# Altium schematic sheet PSU_LM20125_ADJ.SchDoc: Power Supply MAX1831 (1V2)
size A4; Organization: Altium Limited.; Address1: Level 3, 12a Rodborough Rd; Address2: Frenchs Forest 2086; Address3: NSW; Address4: AUSTRALIA; SheetNumber: 1; SheetTotal: 100; PageSetup: Record=PageOptions|CenterHorizontal=True|CenterVertical=True|PrintScale=0.97|XCorrection=1.00|YCorrection=1.00|PrintKind=1|BorderSize=5000000|LeftOffset=0|BottomOffset=0|Orientation=2|PaperLength=1000|PaperWidth=1000|Scale=100|PaperSource=7|PrintQuality=-4|MediaType=1|DitherType=10|PaperKind=A4 (210 x 297 mm)|PrintScaleMode=1
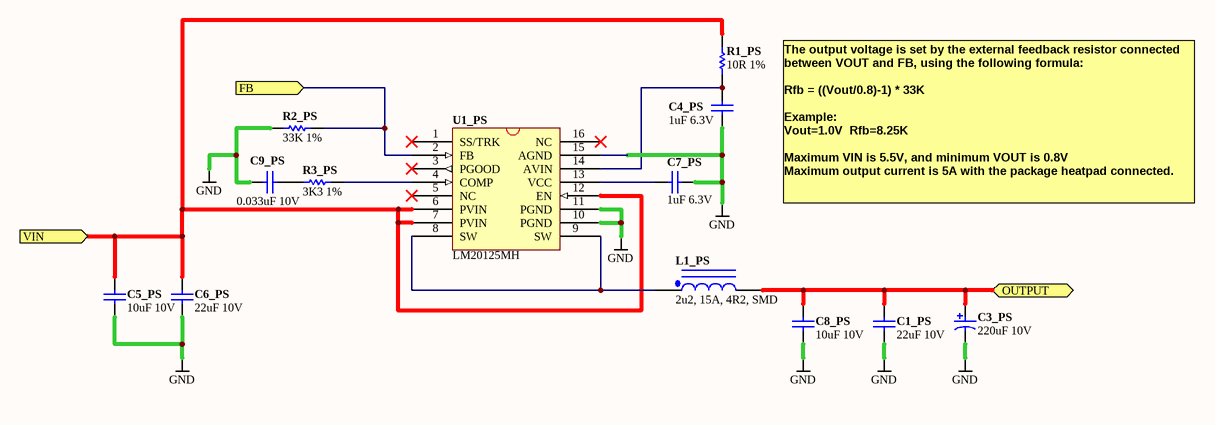
[diagram p0: PSU_LM20125_ADJ.SchDoc]

## Parts
C1_PS  22uF 10V  [CAPC3225-STAR]
C3_PS  220uF 10V  [CAPC7343-STAR]
C4_PS  1uF 6.3V  [CAPC1005-STAR]
C5_PS  10uF 10V  [CAPC2012-STAR]
C6_PS  22uF 10V  [CAPC3225-STAR]
C7_PS  1uF 6.3V  [CAPC1005-STAR]
C8_PS  10uF 10V  [CAPC2012-STAR]
C9_PS  0.033uF 10V  [CAPC1005-STAR]
L1_PS  2u2, 15A, 4R2, SMD  [IND-EPCOS-SMD-B82559]
R1_PS  10R 1%  [RESC1005-STAR]
R2_PS  33K 1%  [RESC1005-STAR]
R3_PS  3K3 1%  [RESC1005-STAR]
U1_PS  LM20125MH  [TSOP65P638-16]

## Ports
FB (in), OUTPUT (bidir), VIN (in)

## Nets
GND: C1_PS.2 C3_PS.2 C4_PS.2 C5_PS.2 C6_PS.2 C7_PS.2 C8_PS.2 C9_PS.1 R2_PS.1 U1_PS.10(PGND) U1_PS.11(PGND) U1_PS.15(AGND)
FB: R2_PS.2 U1_PS.2(FB) ; port FB
OUTPUT: C1_PS.1 C3_PS.1 C8_PS.1 L1_PS.2 ; port OUTPUT
VIN: C5_PS.1 C6_PS.1 R1_PS.1 U1_PS.6(PVIN) U1_PS.7(PVIN) U1_PS.12(EN) ; port VIN
NetC4_PS_1: C4_PS.1 R1_PS.2 U1_PS.14(AVIN)
NetC7_PS_1: C7_PS.1 U1_PS.13(VCC)
NetC9_PS_2: C9_PS.2 R3_PS.1
NetL1_PS_1: L1_PS.1 U1_PS.8(SW) U1_PS.9(SW)
NetR3_PS_2: R3_PS.2 U1_PS.4(COMP)

Not connected (* = marked no-connect by the designer): U1_PS 1(SS/TRK)* 3(PGOOD)* 5(NC)* 16(NC)*

## Notes on the sheet
- The output voltage is set by the external feedback resistor connected between VOUT and FB, using the following formula:
  Rfb = ((Vout/0.8)-1) * 33K
  Example:
  Vout=1.0V 	Rfb=8.25K
  Maximum VIN is 5.5V, and minimum VOUT is 0.8V
  Maximum output current is 5A with the package heatpad connected.
- Sheet Title
- Project Title
- Size:
- Date:
- A4
- Assy:
- Time:
- Revision:
- Sheet
- of
- File:

## Library data of the parts
C1_PS C6_PS = D-101-0021: Capacitor, Ceramic, 22uF -20%/+80% 10V 1210 (3225) Y5V; Polarity: Non-Polarized; Tolerance: -20 / +80 %; Capacitance: 22 uF; Dielectric: Y5V; Mounting Technology: Surface Mount; Rated Voltage: 10 V; Status: Production; Technology: Ceramic; Category: Capacitor
C3_PS = D-101-0088: Capacitor, Tantalum, 220uF 10% 10V MCCT-D (7343-31); Polarity: Polarized; Capacitance: 220 uF; Mounting Technology: Surface Mount; Rated Voltage: 10 V; Status: Unreleased; Technology: Tantalum; Tolerance: 10 %; Category: Capacitor
C4_PS C7_PS = D-101-0082: Capacitor, Ceramic, 1uF 10% 6.3V 0402 (1005) X5R; Polarity: Non-Polarized; Capacitance: 1 uF; Dielectric: X5R; Mounting Technology: Surface Mount; Rated Voltage: 6.3 V; Status: Unreleased; Technology: None; Tolerance: 10 %; Category: Capacitor
C5_PS C8_PS = D-101-0087: Capacitor, Ceramic, 10uF 10% 10V 0805 (2012) X5R; Polarity: Non-Polarized; Capacitance: 10 uF; Dielectric: X5R; Mounting Technology: Surface Mount; Rated Voltage: 10 V; Status: Unreleased; Technology: None; Tolerance: 10 %; Category: Capacitor
C9_PS = D-101-0105: Capacitor, Ceramic, 0.033uF 10% 10V 0402 (1005) X7R; Polarity: Non-Polarized; Capacitance: 0.033 uF; Dielectric: X7R; Mounting Technology: Surface Mount; Rated Voltage: 10 V; Status: Unreleased; Technology: Ceramic; Tolerance: 10 %; Category: Capacitor
L1_PS = D-102-0004: Inductor, 2.2uH, 15A, 4R2, SMD; Inductance: 2.2 uH; Max Input Current: 15 A; Mounting Technology: Surface Mount; Status: Production; Category: Inductor
R1_PS = D-100-0128: Resistor, 10R 1% 0402 (1005); Power Rating: 63 mW; Mounting Technology: Surface Mount; Resistance: 10 R; Status: Production; Tolerance: 1 %; Category: Resistor
R2_PS = D-100-0103: Resistor, 33K 1% 0402 (1005); Power Rating: 63 mW; Mounting Technology: Surface Mount; Resistance: 33 K; Status: Production; Tolerance: 1 %; Category: Resistor
R3_PS = D-100-0098: Resistor, 3K3 1% 0402 (1005); Power Rating: 63 mW; Resistance: 3.3 K; Mounting Technology: Surface Mount; Status: Production; Tolerance: 1 %; Category: Resistor
U1_PS = D-204-0011: LM20125MH, 5A, Synchronous Buck Regulator; Max Input Voltage: 5.5 V; Max Output Voltage: 3.3 V; Min Input Voltage: 3 V; Min Output Voltage: 0.8 V; Supply Voltage: V; Max Output Current: 5 A; Mounting Technology: Surface Mount; Status: Production; Category: IC-Power